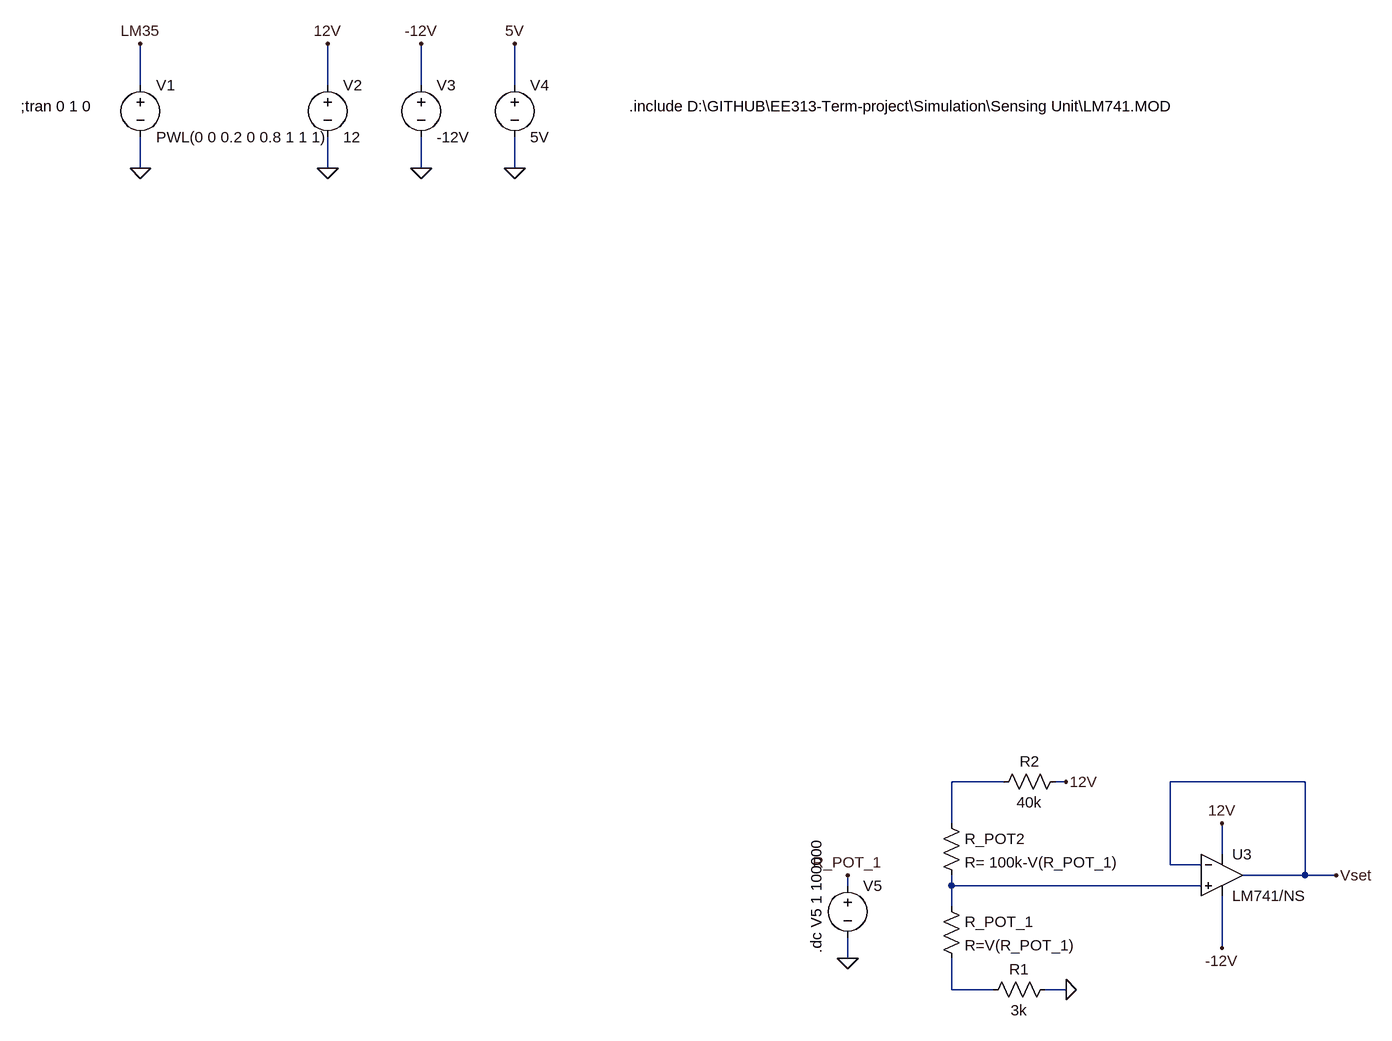
[diagram p0: schematic Set unit.asc]
Set unit.asc, the LTspice schematic file:
Version 4
SHEET 1 4272 2160
WIRE -912 320 -912 256
WIRE -624 320 -624 256
WIRE -480 320 -480 256
WIRE -336 320 -336 256
WIRE -912 448 -912 400
WIRE -624 448 -624 400
WIRE -480 448 -480 400
WIRE -336 448 -336 400
WIRE 416 1392 336 1392
WIRE 512 1392 496 1392
WIRE 880 1392 672 1392
WIRE 336 1456 336 1392
WIRE 752 1504 752 1456
WIRE 672 1520 672 1392
WIRE 720 1520 672 1520
WIRE 880 1536 880 1392
WIRE 880 1536 784 1536
WIRE 928 1536 880 1536
WIRE 176 1552 176 1536
WIRE 336 1552 336 1536
WIRE 720 1552 336 1552
WIRE 336 1584 336 1552
WIRE 752 1648 752 1568
WIRE 176 1664 176 1632
WIRE 336 1712 336 1664
WIRE 400 1712 336 1712
WIRE 512 1712 480 1712
FLAG -912 448 0
FLAG -912 256 LM35
FLAG -624 448 0
FLAG -624 256 12V
FLAG -480 448 0
FLAG -480 256 -12V
FLAG -336 448 0
FLAG -336 256 5V
FLAG 752 1456 12V
FLAG 752 1648 -12V
FLAG 928 1536 Vset
FLAG 512 1392 12V
FLAG 512 1712 0
FLAG 176 1664 0
FLAG 176 1536 R_POT_1
SYMBOL voltage -912 304 R0
WINDOW 123 0 0 Left 0
WINDOW 39 0 0 Left 0
SYMATTR InstName V1
SYMATTR Value PWL(0 0 0.2 0 0.8 1 1 1)
SYMBOL voltage -624 304 R0
WINDOW 123 0 0 Left 0
WINDOW 39 0 0 Left 0
SYMATTR InstName V2
SYMATTR Value 12
SYMBOL voltage -480 304 R0
WINDOW 123 0 0 Left 0
WINDOW 39 0 0 Left 0
SYMATTR InstName V3
SYMATTR Value -12V
SYMBOL voltage -336 304 R0
WINDOW 123 0 0 Left 0
WINDOW 39 0 0 Left 0
SYMATTR InstName V4
SYMATTR Value 5V
SYMBOL OpAmps\\opamp2 752 1472 R0
SYMATTR InstName U3
SYMATTR Value LM741/NS
SYMBOL res 320 1568 R0
SYMATTR InstName R_POT_1
SYMATTR Value R=V(R_POT_1)
SYMBOL res 320 1440 R0
SYMATTR InstName R_POT2
SYMATTR Value R= 100k-V(R_POT_1)
SYMBOL res 512 1376 R90
WINDOW 0 0 56 VBottom 2
WINDOW 3 32 56 VTop 2
SYMATTR InstName R2
SYMATTR Value 40k
SYMBOL res 496 1696 R90
WINDOW 0 0 56 VBottom 2
WINDOW 3 32 56 VTop 2
SYMATTR InstName R1
SYMATTR Value 3k
SYMBOL voltage 176 1536 R0
WINDOW 123 0 0 Left 0
WINDOW 39 0 0 Left 0
SYMATTR InstName V5
SYMATTR Value ""
TEXT -160 352 Left 2 !.include D:\\GITHUB\\EE313-Term-project\\Simulation\\Sensing Unit\\LM741.MOD
TEXT -1096 352 Left 2 !;tran 0 1 0
TEXT 128 1480 VRight 2 !.dc V5 1 100000

The netlist it stands for:
* Set unit.asc
V1 LM35 0 PWL(0 0 0.2 0 0.8 1 1 1)
V2 12V 0 12
V3 -12V 0 -12V
V4 5V 0 5V
XU3 N002 Vset 12V -12V Vset LM741/NS  ; pins In+ In- V+ V- OUT
R_POT_1 N002 N003 R=V(R_POT_1)
R_POT2 N001 N002 R= 100k-V(R_POT_1)
R2 12V N001 40k
R1 0 N003 3k
V5 R_POT_1 0
.include D:\GITHUB\EE313-Term-project\Simulation\Sensing Unit\LM741.MOD
;tran 0 1 0
.dc V5 1 100000
.backanno
.end